# EAGLE schematic Eency_v01 (EAGLE 6.4)
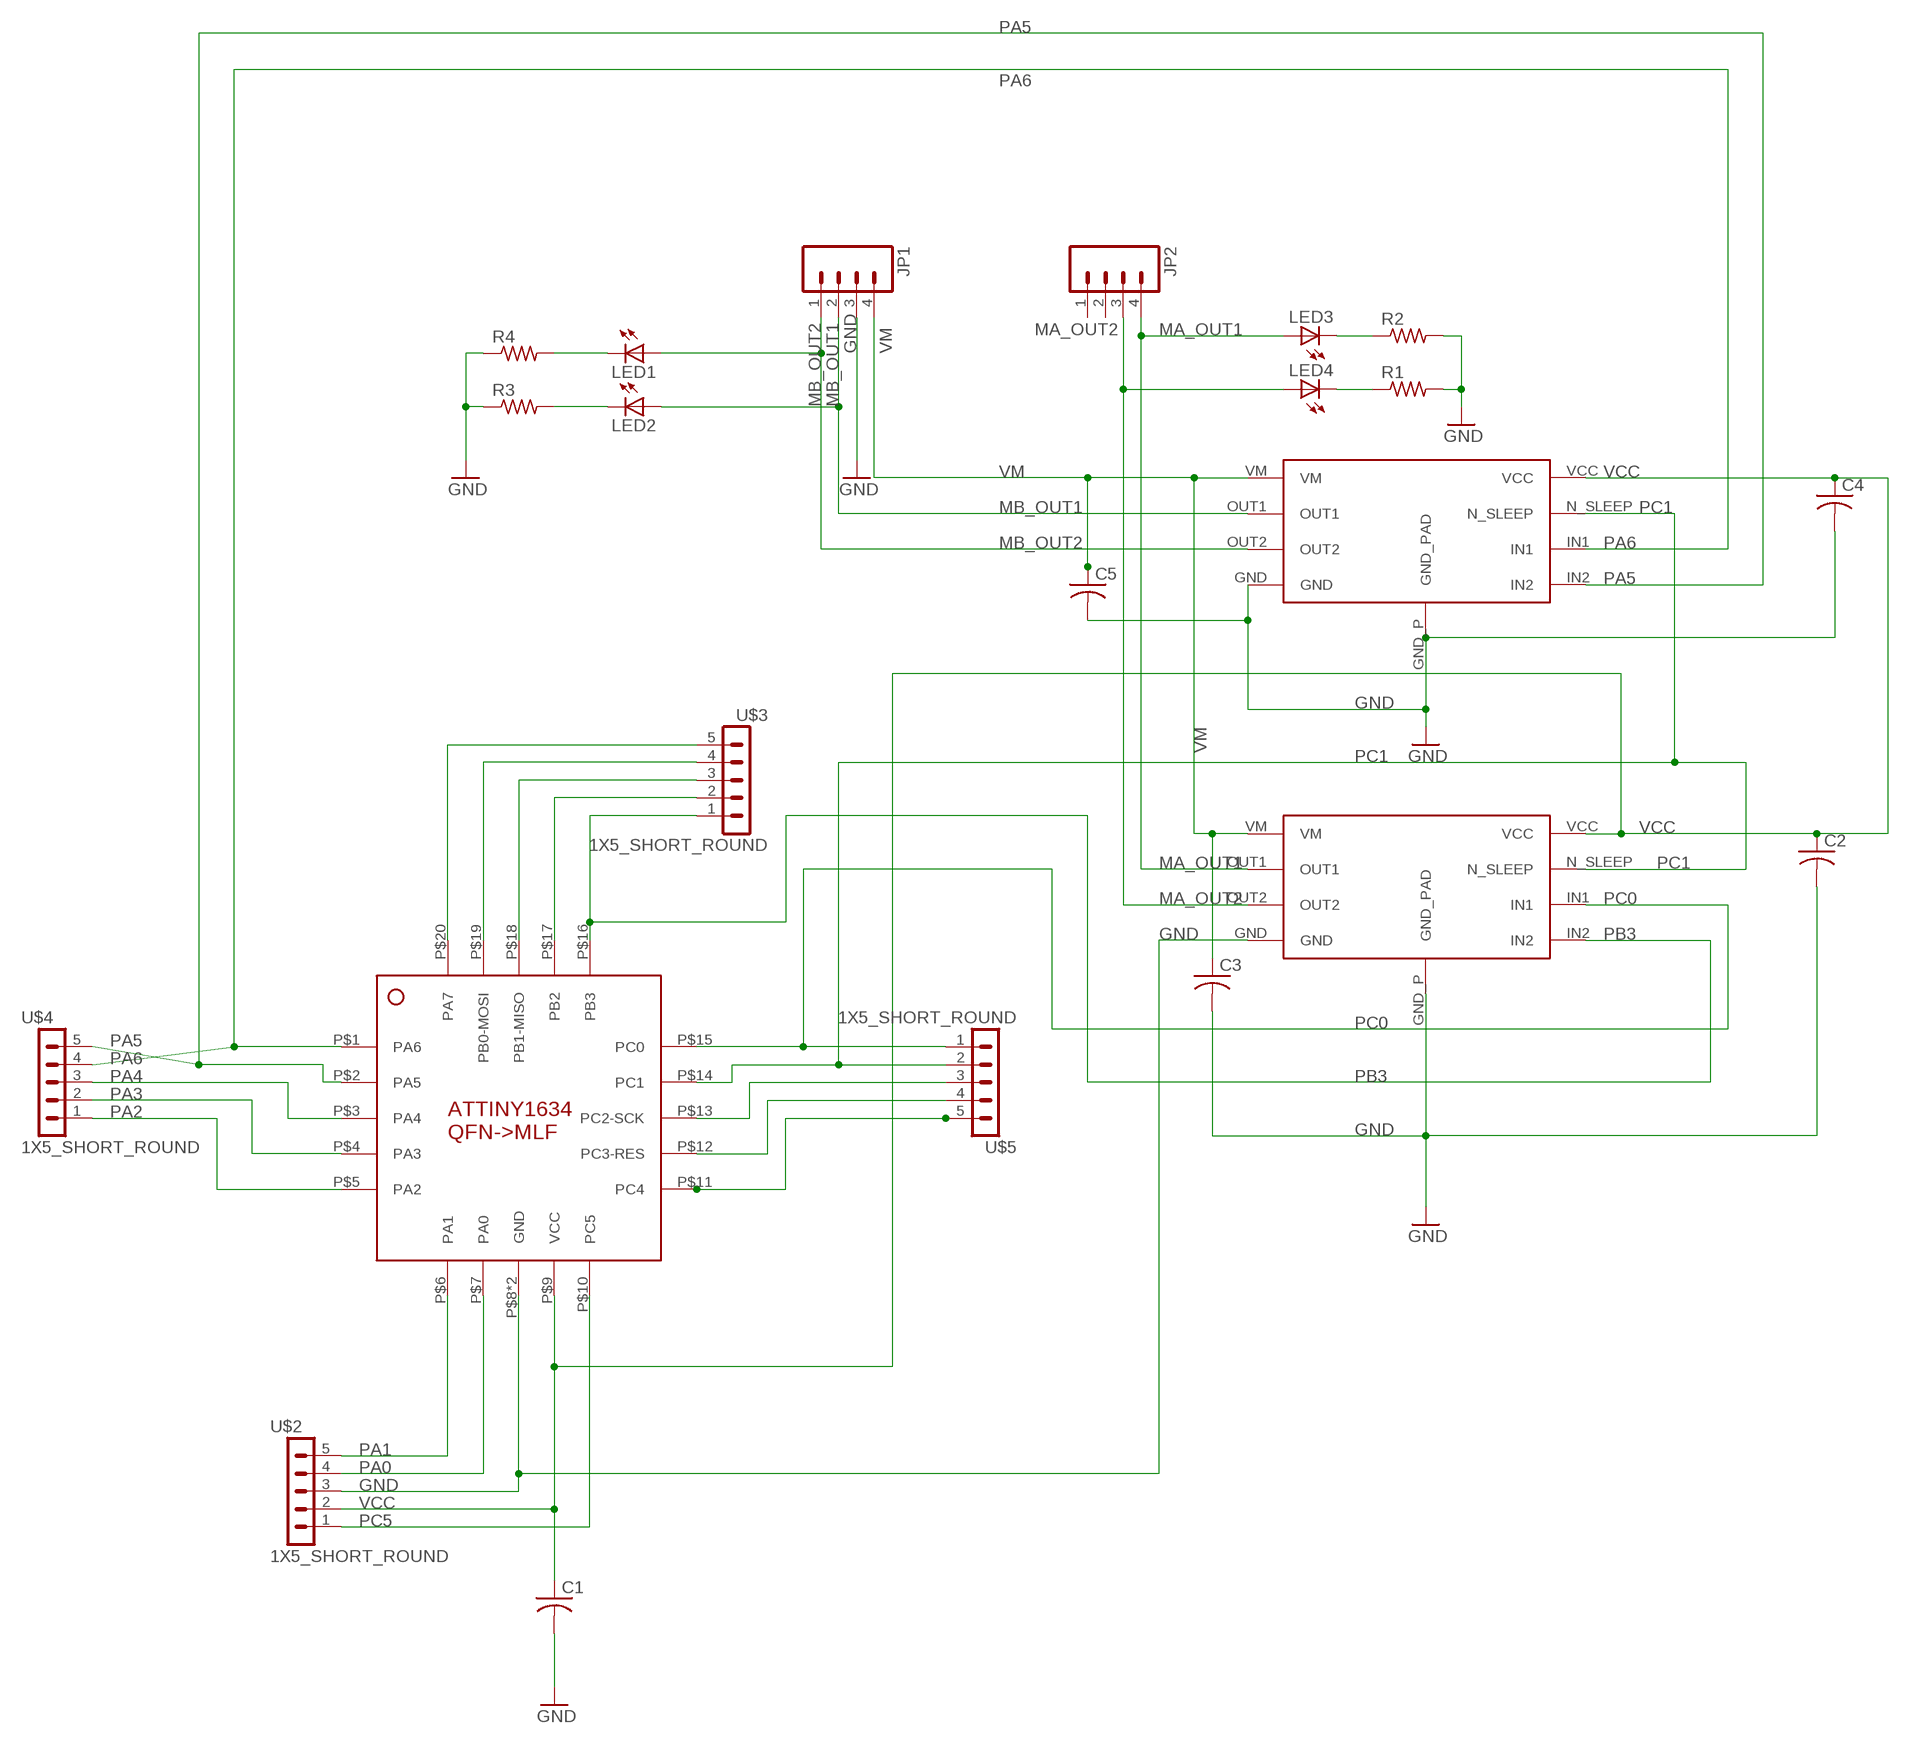
[diagram p0: schematic, sheet 1]

## Parts
C1  C-USC0402K  [C0402K]
C2  C-USC0402K  [C0402K]
C3  C-USC0402K  [C0402K]
C4  C-USC0402K  [C0402K]
C5  C-USC0402K  [C0402K]
JP1  M04PTH  [1X04]
JP2  M04PTH  [1X04]
LED1  LEDSML0603  [SML0603]
LED2  LEDSML0603  [SML0603]
LED3  LEDSML0603  [SML0603]
LED4  LEDSML0603  [SML0603]
R1  R-US_R0402  [R0402]
R2  R-US_R0402  [R0402]
R3  R-US_R0402  [R0402]
R4  R-US_R0402  [R0402]
U$1  ATTINY1634  [MLF20/ATTINY13]
U$2  1X5_SHORT_ROUND  [1X5_SHORT_ROUND]
U$3  1X5_SHORT_ROUND  [1X5_SHORT_ROUND]
U$4  1X5_SHORT_ROUND  [1X5_SHORT_ROUND]
U$5  1X5_SHORT_ROUND  [1X5_SHORT_ROUND]
U$8  DRV8837  [WSON-8]
U$9  DRV8837  [WSON-8]

## Nets
GND: C1.2 C2.2 C3.2 C4.2 C5.2 JP1.3 R1.2 R2.2 R3.1 R4.1 U$1.P$8(GND) U$1.P$21(GND) U$2.3 U$8.GND U$8.GND_P(GND_PAD) U$9.GND U$9.GND_P(GND_PAD)
MA_OUT1: JP2.4 LED3.A U$8.OUT1
MA_OUT2: JP2.3 LED4.A U$8.OUT2
MB_OUT1: JP1.2 LED2.A U$9.OUT1
MB_OUT2: JP1.1 LED1.A U$9.OUT2
N$1: U$1.P$18(PB1-MISO) U$3.3
N$2: U$1.P$19(PB0-MOSI) U$3.4
N$3: LED3.C R2.1
N$4: LED4.C R1.1
N$5: LED1.C R4.2
N$6: LED2.C R3.2
PA0: U$1.P$7(PA0) U$2.4
PA1: U$1.P$6(PA1) U$2.5
PA2: U$1.P$5(PA2) U$4.1
PA3: U$1.P$4(PA3) U$4.2
PA4: U$1.P$3(PA4) U$4.3
PA5: U$1.P$2(PA5) U$4.5 U$9.IN2
PA6: U$1.P$1(PA6) U$4.4 U$9.IN1
PA7: U$1.P$20(PA7) U$3.5
PB2: U$1.P$17(PB2) U$3.2
PB3: U$1.P$16(PB3) U$3.1 U$8.IN2
PC0: U$1.P$15(PC0) U$5.1 U$8.IN1
PC1: U$1.P$14(PC1) U$5.2 U$8.N_SLEEP U$9.N_SLEEP
PC2-SCK: U$1.P$13(PC2-SCK) U$5.3
PC3-RES: U$1.P$12(PC3-RES) U$5.4
PC4: U$1.P$11(PC4) U$5.5
PC5: U$1.P$10(PC5) U$2.1
VCC: C1.1 C2.1 C4.1 U$1.P$9(VCC) U$2.2 U$8.VCC U$9.VCC
VM: C3.1 C5.1 JP1.4 U$8.VM U$9.VM
Unconnected: JP2.1 JP2.2

## Library data of the parts
C1-C5 = resistor:C-US: CAPACITOR, American symbol
JP1 JP2 = SparkFun:M04: Header 4 Standard 4-pin 0.1" header. Use with straight break away headers (SKU : PRT-00116), right angle break away headers (PRT-00553), swiss pins (PRT-00743), machine pins (PRT-00117), and female headers (PRT-00115). Molex polarized connector foot print use with SKU : PRT-08231 with associated crimp pins and housings. 1MM SMD Version SKU: PRT-10208
LED1-LED4 = led:LED: LED OSRAM: - CHIPLED LG R971, LG N971, LY N971, LG Q971, LY Q971, LO R971, LY R971 LH N974, LH R974 LS Q976, LO Q976, LY Q976 LO Q996 - Hyper CHIPLED LW Q18S LB Q993, LB Q99A, LB R99A - SideLED LS A670, LO A670, LY A670, LG A670, LP A670 LB A673, LV A673, LT A673, LW A673 LH A674 LY A675 LS A676, LA A676, LO A676, LY A676, LW A676 LS A679, LY A679, LG A679 - Hyper Micro SIDELED® LS Y876, LA Y876, LO Y876, LY Y876 LT Y87S - SmartLED LW L88C, LW L88S LB L89C, LB L89S, LG L890 LS L89K, LO L89K, LY L89K LS L896, LA L896, LO L896, LY L896 - TOPLED LS T670, LO T670, LY T670, LG T670, LP T670 LSG T670, LSP T670, LSY T670, LOP T670, LYG T670 LG T671, LOG T671, LSG T671 LB T673, LV T673, LT T673, LW T673 LH T674 LS T676, LA T676, LO T676, LY T676, LB T676, LH T676, LSB T676, LW T676 LB T67C, LV T67C, LT T67C, LS T67K, LO T67K, LY T67K, LW E67C LS E67B, LA E67B, LO E67B, LY E67B, LB E67C, LV E67C, LT E67C LW T67C LS T679, LY T679, LG T679 LS T770, LO T770, LY T770, LG T770, LP T770 LB T773, LV T773, LT T773, LW T773 LH T774 LS E675, LA E675, LY E675, LS T675 LS T776, LA T776, LO T776, LY T776, LB T776 LHGB T686 LT T68C, LB T68C - Hyper Mini TOPLED® LB M676 - Mini TOPLED Santana® LG M470 LS M47K, LO M47K, LY M47K Source: http://www.osram.convergy.de LUXEON: - LUMILED® LXK2-PW12-R00, LXK2-PW12-S00, LXK2-PW14-U00, LXK2-PW14-V00 LXK2-PM12-R00, LXK2-PM12-S00, LXK2-PM14-U00 LXK2-PE12-Q00, LXK2-PE12-R00, LXK2-PE12-S00, LXK2-PE14-T00, LXK2-PE14-U00 LXK2-PB12-K00, LXK2-PB12-L00, LXK2-PB12-M00, LXK2-PB14-N00, LXK2-PB14-P00, LXK2-PB14-Q00 LXK2-PR12-L00, LXK2-PR12-M00, LXK2-PR14-Q00, LXK2-PR14-R00 LXK2-PD12-Q00, LXK2-PD12-R00, LXK2-PD12-S00 LXK2-PH12-R00, LXK2-PH12-S00 LXK2-PL12-P00, LXK2-PL12-Q00, LXK2-PL12-R00 Source: www.luxeon.com KINGBRIGHT: KA-3528ASYC Source: www.kingbright.com
R1-R4 = resistor:R-US_: RESISTOR, American symbol
U$1 = avr-5:ATTINY1634
U$2-U$5 = Random parts(01-14-14):1X5_SHORT_ROUND
U$8 U$9 = tinycircuits:DRV8837